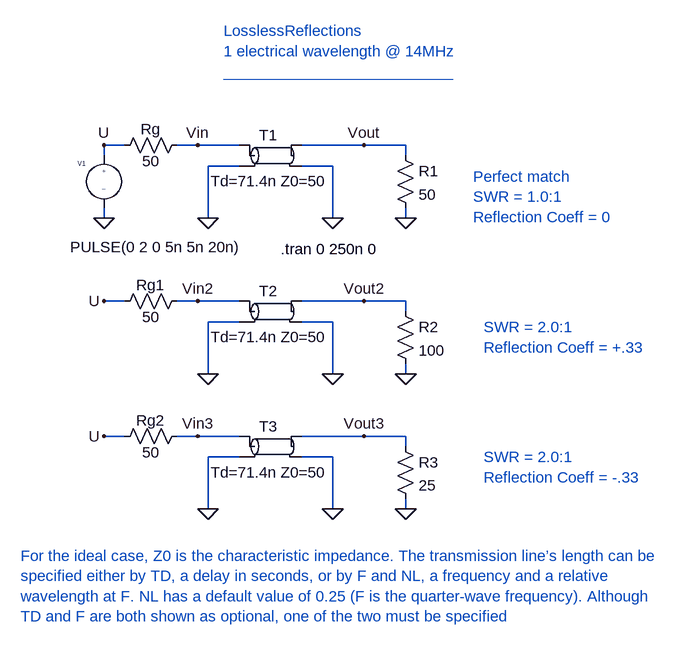
[diagram p0: schematic transmissionline_reflections.asc]
transmissionline_reflections.asc, the LTspice schematic file:
Version 4
SHEET 1 880 684
WIRE -352 -48 -384 -48
WIRE -240 -48 -272 -48
WIRE -176 -48 -240 -48
WIRE 16 -48 -80 -48
WIRE 80 -48 16 -48
WIRE -384 -32 -384 -48
WIRE 80 -32 80 -48
WIRE -176 -16 -224 -16
WIRE -32 -16 -80 -16
WIRE -384 64 -384 48
WIRE -224 64 -224 -16
WIRE -32 64 -32 -16
WIRE 80 64 80 48
WIRE -352 192 -384 192
WIRE -240 192 -272 192
WIRE -176 192 -240 192
WIRE 16 192 -80 192
WIRE 80 192 16 192
WIRE 80 208 80 192
WIRE -176 224 -224 224
WIRE -32 224 -80 224
WIRE -224 304 -224 224
WIRE -32 304 -32 224
WIRE 80 304 80 288
WIRE -352 400 -384 400
WIRE -240 400 -272 400
WIRE -176 400 -240 400
WIRE 16 400 -80 400
WIRE 80 400 16 400
WIRE 80 416 80 400
WIRE -176 432 -224 432
WIRE -32 432 -80 432
WIRE -224 512 -224 432
WIRE -32 512 -32 432
WIRE 80 512 80 496
FLAG -384 64 0
FLAG 80 64 0
FLAG -32 64 0
FLAG -224 64 0
FLAG -384 -48 U
FLAG -240 -48 Vin
FLAG 16 -48 Vout
FLAG 80 304 0
FLAG -32 304 0
FLAG -224 304 0
FLAG -240 192 Vin2
FLAG 16 192 Vout2
FLAG -384 192 U
FLAG 80 512 0
FLAG -32 512 0
FLAG -224 512 0
FLAG -240 400 Vin3
FLAG 16 400 Vout3
FLAG -384 400 U
SYMBOL tline -128 -32 R0
WINDOW 0 -3 -47 Top 2
WINDOW 3 -2 55 Bottom 2
SYMATTR InstName T1
SYMATTR Value Td=71.4n Z0=50
SYMBOL res -368 -32 R270
WINDOW 0 25 56 VTop 2
WINDOW 3 7 56 VBottom 2
SYMATTR InstName Rg
SYMATTR Value 50
SYMBOL source-V -384 -48 M0
WINDOW 3 -211 157 Left 2
WINDOW 123 0 0 Left 2
WINDOW 39 0 0 Left 2
SYMATTR Value PULSE(0 2 0 5n 5n 20n)
SYMATTR InstName V1
SYMBOL res 64 -48 R0
SYMATTR InstName R1
SYMATTR Value 50
SYMBOL tline -128 208 R0
WINDOW 0 -3 -47 Top 2
WINDOW 3 -2 55 Bottom 2
SYMATTR InstName T2
SYMATTR Value Td=71.4n Z0=50
SYMBOL res -368 208 R270
WINDOW 0 25 56 VTop 2
WINDOW 3 7 56 VBottom 2
SYMATTR InstName Rg1
SYMATTR Value 50
SYMBOL res 64 192 R0
SYMATTR InstName R2
SYMATTR Value 100
SYMBOL tline -128 416 R0
WINDOW 0 -3 -47 Top 2
WINDOW 3 -2 55 Bottom 2
SYMATTR InstName T3
SYMATTR Value Td=71.4n Z0=50
SYMBOL res -368 416 R270
WINDOW 0 25 56 VTop 2
WINDOW 3 7 56 VBottom 2
SYMATTR InstName Rg2
SYMATTR Value 50
SYMBOL res 64 400 R0
SYMATTR InstName R3
SYMATTR Value 25
TEXT 200 232 Left 2 ;SWR = 2.0:1\nReflection Coeff = +.33
TEXT 184 0 Left 2 ;Perfect match\nSWR = 1.0:1\nReflection Coeff = 0
TEXT 200 432 Left 2 ;SWR = 2.0:1\nReflection Coeff = -.33
TEXT -112 112 Left 2 !.tran 0 250n 0
TEXT -200 -224 Left 2 ;LosslessReflections\n1 electrical wavelength @ 14MHz\n___________________________
TEXT -512 584 Left 2 ;For the ideal case, Z0 is the characteristic impedance. The transmission line’s length can be\nspecified either by TD, a delay in seconds, or by F and NL, a frequency and a relative\nwavelength at F. NL has a default value of 0.25 (F is the quarter-wave frequency). Although\nTD and F are both shown as optional, one of the two must be specified

The netlist it stands for:
* transmissionline_reflections.asc
T1 Vin 0 Vout 0 Td=71.4n Z0=50
Rg U Vin 50
V1 U 0 PULSE(0 2 0 5n 5n 20n)
R1 Vout 0 50
T2 Vin2 0 Vout2 0 Td=71.4n Z0=50
Rg1 U Vin2 50
R2 Vout2 0 100
T3 Vin3 0 Vout3 0 Td=71.4n Z0=50
Rg2 U Vin3 50
R3 Vout3 0 25
* SWR = 2.0:1
* Reflection Coeff = +.33
* Perfect match
* SWR = 1.0:1
* Reflection Coeff = 0
* SWR = 2.0:1
* Reflection Coeff = -.33
.tran 0 250n 0
* LosslessReflections
* 1 electrical wavelength @ 14MHz
* ___________________________
* For the ideal case, Z0 is the characteristic impedance. The transmission line’s length can be
* specified either by TD, a delay in seconds, or by F and NL, a frequency and a relative
* wavelength at F. NL has a default value of 0.25 (F is the quarter-wave frequency). Although
* TD and F are both shown as optional, one of the two must be specified
.backanno
.end